# EAGLE design Adafruit_Breadboard_NeoPixel (EAGLE 6.3)
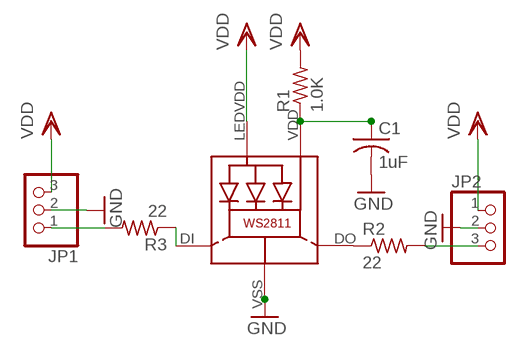
[diagram p0: schematic, sheet 1]

## Parts
C1  1uF  C-USC0603K  [C0603K]
JP1  PINHD-1X3CB  [1X03-CLEANBIG]
JP2  PINHD-1X3CB  [1X03-CLEANBIG]
LED1  WS28115050  [WS28115050]
R1  1.0K  R-US_R0603  [R0603]
R2  22  R-US_R0603  [R0603]
R3  22  R-US_R0603  [R0603]

## Nets
GND: C1.2 JP1.2 JP2.2 LED1.VSS(GND)
IN: JP1.1 R3.2
N$1: LED1.DO R2.1
N$2: LED1.DI R3.1
N$8: C1.1 LED1.VDD R1.1
OUT: JP2.3 R2.2
VDD: JP1.3 JP2.1 LED1.LEDVDD R1.2

## Library data of the parts
C1 = adafruit:C-US: CAPACITOR, American symbol
JP1 JP2 = adafruit:PINHD-1X3: PIN HEADER
LED1 = microbuilder:WS28115050
R1-R3 = adafruit:R-US_: RESISTOR, American symbol

## Board
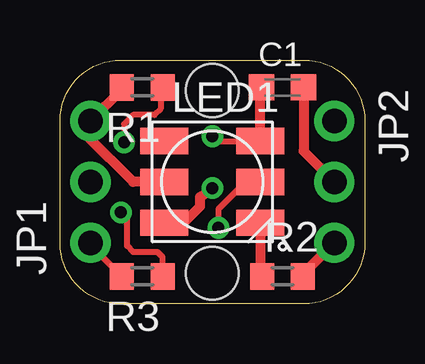
[diagram p1: board, top side]
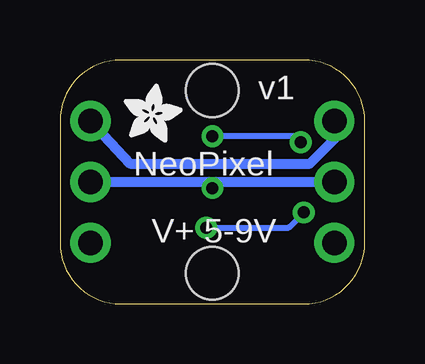
[diagram p2: board, bottom side, seen from below]

Size 12.7 x 10.16 mm. Coordinates in mm from the lower left corner, seen from the top.
Outline: 2.54,10.16 10.16,10.16 arc-90 12.7,7.62 12.7,2.54 arc-90 10.16,0 2.54,0 arc-90 0,2.54 0,7.62 arc-90 2.54,10.16
Copper layers (1*16): Top 0.035mm / dielectric 1.5mm / Bottom 0.035mm
Design rules "default": minimum track width 10mil, minimum drill 19mil, track to track 8mil, track to pad 8mil, pad to pad 8mil, via to via 8mil, smd to smd 8mil, copper to edge 10mil, drill to drill 8mil, minimum pad ring 10mil, minimum via ring 8mil, stop-mask expansion 4mil, vias tented up to drill 20mil, thermal gap 10mil
Holes 2.2 mm at 6.35,8.89 6.35,1.27

### Footprints (pad centres in the part's own frame; a part is rotated, then mirrored left to right if it is on the bottom)
C0603K = smd 1.05 x 1.08: 1 -0.875,0; 2 0.875,0
1X03-CLEANBIG = drill 1.016 pad 1.676: 1 -2.54,0; 2 0,0; 3 2.54,0
WS28115050 = smd 2 x 1.1: DI 2,0; DO 2,-1.7; LEDVDD -2,0; NC -2,1.7; VDD 2,1.7; VSS -2,-1.7
R0603 = smd 1 x 1.1: 1 -0.85,0; 2 0.85,0

### Placement (x,y rotation side)
C1  9.27,9.02 0 top
JP1  1.27,5.08 90 top
JP2  11.43,5.08 270 top
LED1  6.35,5.08 0 top
R1  3.43,9.02 180 top
R2  9.27,1.14 0 top
R3  3.43,1.14 180 top
U$1  [ADAFRUIT_2.5MM]  10.03,6.73 0 bottom

### Tracks (layer width: path | path; a pad name or v marks a point on that pad's centre or on a via)
GND  (via drill 0.5)
  Top 0.406: C1.2 10.15,6.36 JP2.2 | 4.3,3.43 LED1.VSS 5.16,3.38 5.84,4.06 5.84,4.45 v6.35,4.83
  Bottom 0.406: JP2.2 6.35,5.08 | 6.35,5.08 JP1.2 | v6.35,4.83 6.35,5.08
IN
  Top 0.254: 1.27,2.45 R3.2
  Top 0.406: JP1.1 1.27,2.45
N$1
  Top 0.406: LED1.DO 8.35,1.21 R2.1
N$2  (via drill 0.5)
  Top 0.254: LED1.DI 7.75,5.08 6.6,3.94 v6.6,3.17 | R3.1 4.28,1.94 4.06,2.16 3.05,2.16 2.79,2.41 2.79,3.56 v2.54,3.81
  Bottom 0.254: v6.6,3.17 3.17,3.17 v2.54,3.81
N$8  (via drill 0.5)
  Top 0.254: R1.1 4.19,8.93 4.19,8.13 3.94,7.87 3.05,7.87 2.67,7.49 v2.67,6.73 | v6.35,6.99 6.55,6.78 LED1.VDD
  Top 0.406: LED1.VDD 8.35,8.97 C1.1
  Bottom 0.254: v2.67,6.73 2.92,6.99 v6.35,6.99
OUT
  Top 0.406: R2.2 10.12,1.23 JP2.3
VDD
  Top 0.406: R1.2 2.58,8.93 JP1.3 | JP1.3 1.27,7.49 | LED1.LEDVDD 3.05,5.08 1.14,6.99 1.14,7.49 JP1.3 | 1.27,7.37 JP1.3
  Bottom 0.406: JP2.1 9.78,5.84 2.29,5.84 1.27,6.86 JP1.3

### Text on the board
bPlace: v1 | NeoPixel | V+ 5-9V
tDocu: + | + | G | G | In | O